# Altium schematic sheet Power_Logic.SchDoc
size A4
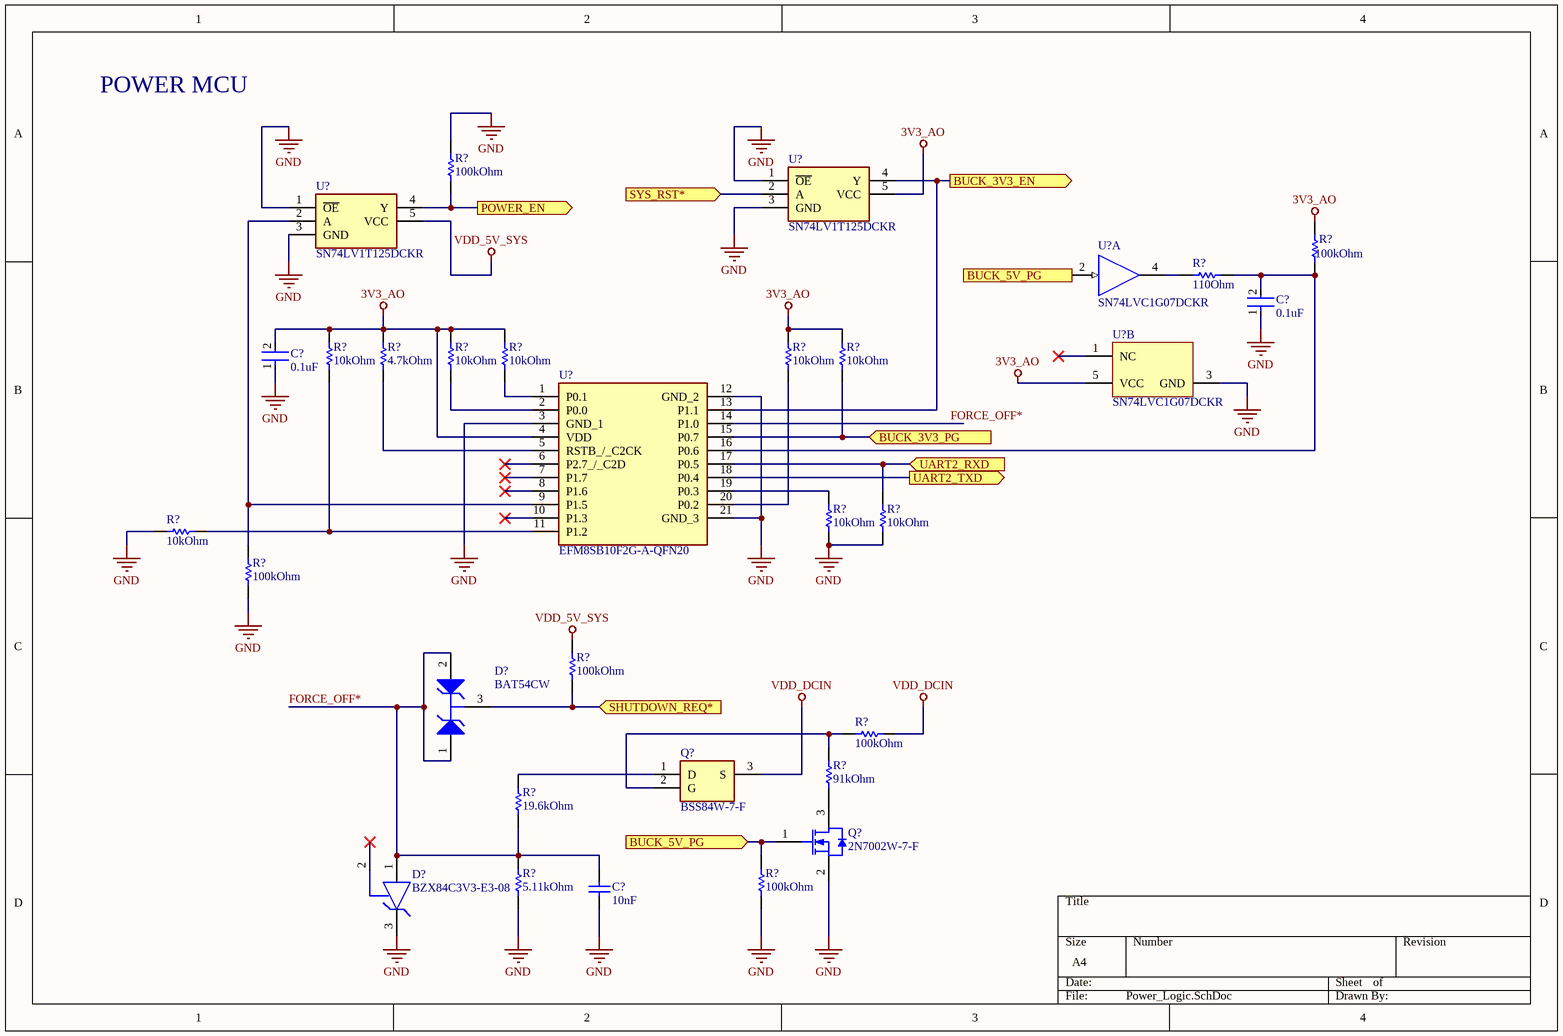
[diagram p0: Power_Logic.SchDoc]

## Parts
(Parts that share a designator on the sheet are numbered #1, #2 ... from top to bottom, then left to right.)
C?#1  0.1uF  [FP-C0603C-CF-MFG]
C?#2  0.1uF  [FP-C0603C-CF-MFG]
C?#3  10nF  [CAPC0603X33X15NL03T05]
D?#1  BAT54CW  [NXP-SOT323-3_L]
D?#2  BZX84C3V3-E3-08  [FP-6_541-5014_01-4-MFG]
Q?#1  BSS84W-7-F  [SOT65P210X110-3N]
Q?#2  2N7002W-7-F  [DIOD-SOT323-3_V]
R?#1  100kOhm  [RESC2013X50X30NL20T20]
R?#2  100kOhm  [RESC2013X50X30NL20T20]
R?#3  110Ohm  [RESC1609X50X30NL10T20]
R?#4  10kOhm  [RESC1608X55X30ML20T20]
R?#5  4.7kOhm  [RESC1609X50X30LL8T20]
R?#6  10kOhm  [RESC1608X55X30ML20T20]
R?#7  10kOhm  [RESC1608X55X30ML20T20]
R?#8  10kOhm  [RESC1608X55X30ML20T20]
R?#9  10kOhm  [RESC1608X55X30ML20T20]
R?#10  10kOhm  [RESC1608X55X30ML20T20]
R?#11  10kOhm  [RESC1608X55X30ML20T20]
R?#12  10kOhm  [RESC1608X55X30ML20T20]
R?#13  100kOhm  [RESC2013X50X30NL20T20]
R?#14  100kOhm  [RESC2013X50X30NL20T20]
R?#15  100kOhm  [RESC2013X50X30NL20T20]
R?#16  91kOhm  [RESC1609X50X30NL10T20]
R?#17  19.6kOhm  [RESC1005X35X20NL05T10]
R?#18  100kOhm  [RESC2013X50X30NL20T20]
R?#19  5.11kOhm  [RESC1005X40X25LL05T05]
U?#1  SN74LV1T125DCKR  [SOT65P210X110-5N]
U?#2  SN74LV1T125DCKR  [SOT65P210X110-5N]
U?#3  SN74LVC1G07DCKR  [DCK0005A_M]  (part A of 2)
U?#4  SN74LVC1G07DCKR  [DCK0005A_M]  (part B of 2)
U?#5  EFM8SB10F2G-A-QFN20  [EFM8SB10F8GAQFN20R]

## Ports
BUCK_3V3_EN (out), BUCK_3V3_PG (in), BUCK_5V_PG (in), POWER_EN (out), SHUTDOWN_REQ* (in), SYS_RST* (in), UART2_RXD (in), UART2_TXD (out)

## Nets
3V3_AO: C?#2.2 R?#2.1 R?#4.2 R?#5.2 R?#6.2 R?#7.2 R?#8.2 R?#9.2 U?#1.5(VCC) U?#4.5(VCC) U?#5.4(VDD)
GND: C?#1.1 C?#2.1 C?#3.1 D?#2.3(C) Q?#2.2(S) R?#1.1 R?#10.2 R?#11.2 R?#12.2 R?#13.2 R?#18.2 R?#19.1 U?#1.1(~{OE}) U?#1.3(GND) U?#2.1(~{OE}) U?#2.3(GND) U?#4.3(GND) U?#5.3(GND_1) U?#5.12(GND_2) U?#5.21(GND_3)
VDD_5V_SYS: R?#14.1 U?#2.5(VCC)
VDD_DCIN: Q?#1.3(S) R?#15.2
BUCK_3V3_EN: U?#1.4(Y) U?#5.13(P1.1) ; port BUCK_3V3_EN
BUCK_3V3_PG: R?#9.1 U?#5.15(P0.7) ; port BUCK_3V3_PG
BUCK_5V_PG: Q?#2.1(G) R?#18.1 U?#3.2(A) ; port BUCK_5V_PG
FORCE_OFF*: C?#3.2 D?#1.1(A1) D?#1.2(A2) D?#2.1(A) R?#17.1 R?#19.2 U?#5.14(P1.0)
POWER_EN: R?#1.2 U?#2.4(Y) ; port POWER_EN
SHUTDOWN_REQ*: D?#1.3(K) R?#14.2 ; port SHUTDOWN_REQ*
SYS_RST*: U?#1.2(A) ; port SYS_RST*
UART2_RXD: R?#11.1 U?#5.17(P0.5) ; port UART2_RXD
UART2_TXD: U?#5.18(P0.4) ; port UART2_TXD
NetC?#1_2: C?#1.2 R?#2.2 R?#3.2 U?#5.16(P0.6)
NetQ?#1_1: Q?#1.1(D) R?#17.2
NetQ?#1_2: Q?#1.2(G) R?#15.1 R?#16.1
NetQ?#2_3: Q?#2.3(D) R?#16.2
NetR?#3_1: R?#3.1 U?#3.4(Y)
NetR?#4_1: R?#4.1 R?#12.1 U?#5.11(P1.2)
NetR?#5_1: R?#5.1 U?#5.5(RSTB_/_C2CK)
NetR?#6_1: R?#6.1 U?#5.2(P0.0)
NetR?#7_1: R?#7.1 U?#5.1(P0.1)
NetR?#8_1: R?#8.1 U?#5.20(P0.2)
NetR?#10_1: R?#10.1 U?#5.19(P0.3)
NetR?#13_1: R?#13.1 U?#2.2(A) U?#5.9(P1.5)

Not connected (* = marked no-connect by the designer): D?#2 2(NC)*; U?#4 1(NC)*; U?#5 6(P2.7_/_C2D)* 7(P1.7)* 8(P1.6)* 10(P1.3)*

## Notes on the sheet
- POWER MCU

## Library data of the parts
C?#1 C?#2 = CMP-03020-001379-1: CAP CER 0.1UF 50V X7R 0603; Manufacturer: KEMET; Manufacturer Part Number: C0603C104K5RACTU; Tolerance: 0.1; Temperature Coefficient: 30ppm/°C; Material: Ceramic; Automotive Grade: Grade 1; Value: 0.10 μF; Temperature: -55°C to +125°C; RoHS: TRUE; Temperature Range High: +125°C; Lead Free: Yes; Octopart: https://octopart.com/c0603c104k5ractu-kemet-139244; Digikey Description: CAP CER 0.1UF 50V X7R 0603; Category: Cap; Package: C0603C-CF; ComponentLink2Description: Datasheet; Temperature Range Low: -55°C; Device Class L1: Passive Components; Voltage Rating: 50 V; Automotive: Yes; Device Class L3: Ceramic Capacitors; ComponentLink2URL: https://api.kemet.com/component-edge/download/datasheet/C0603C100J5GACAUTO.pdf; Capacitance: 0.10 μF; Device Class L2: Capacitors; Temperature Characteristic: X7R; Height: 0.87mm
C?#3 = CMP-2010-00230-1: Part Number: 0201ZC103KAT2A; Manufacturer: AVX Interconnect / Elco
D?#1 = CMP-0417-00001-1: SOT-323 Plastic-Encapsulated Diode; Manufacturer: NXP Semiconductors; Non-repetitive Peak Reverse Current: 600 mA; Max Forward Current: 200 mA; PackageVersion: Mar-06; ComponentLink3URL: http://www.nxp.com/documents/outline_drawing/sot323_po.pdf; Mounting Technology: Surface Mount; ComponentLink3Description: Package Specification; ComponentLink2Description: Datasheet; PartNumber: BAT54CW; Storage Temperature: -65 to 150 degC; DatasheetVersion: Rev. 3, 11/2012; ComponentLink2URL: http://www.nxp.com/documents/data_sheet/BAT54W_SER.pdf; ComponentLink1Description: Manufacturer URL; ComponentLink1URL: http://www.nxp.com/; PackageDescription: 3-Pin SOT323, 2 x 1.3 mm Body, 0.65 mm Pitch; PackageReference: SOT323-3
D?#2 = CMP-02541-000017-1: DIODE ZENER 3.3V 300MW SOT23; Manufacturer: Vishay; Reverse Voltage: 1V; Zener Impedance: 95Ω; Max Junction Temp: +150°C; Max Zener Voltage: 3.5V; Max Reverse Leakage Current: 5uA; Description: Diode Zener Single 3.3V 5% 300mW 3-Pin SOT-23 T/R; Device Class L1: Discrete Semiconductors; Digikey Description: DIODE ZENER 3.3V 300MW SOT23; ComponentLink2URL: http://www.vishay.com/docs/85763/bzx84v.pdf; Lead Free: Yes; Package: 6.541-5014.01-4; Automotive: No; Device Class L3: Zener Diodes; Mouser Description: Zener Diodes 3.3 Volt 0.35W 5%; Temperature Range Low: -55°C; Nom Zener Voltage: 3.3V; Manufacturer Part Number: BZX84C3V3-E3-08; Octopart: https://octopart.com/bzx84c3v3-e3-08-vishay-30324846; RoHS: TRUE; Device Class L2: Diodes; Category: Diode; Temperature Range High: +150°C; Temperature: -55°C to +150°C; Height: 1.15mm; ComponentLink2Description: Datasheet; Power Dissipation: 300mW
Q?#1 = BSS84W-7-F: Undefined or Miscellaneous; Manufacturer_Name: Diodes Inc.; Datasheet Link: http://componentsearchengine.com/Datasheets/1/BSS84W-7-F.pdf; Manufacturer_Part_Number: BSS84W-7-F; Arrow Part Number: BSS84W-7-F; Arrow Price/Stock: https://www.arrow.com/en/products/bss84w-7-f/diodes-incorporated; Mouser Part Number: 621-BSS84W-F; Mouser Price/Stock: https://www.mouser.co.uk/ProductDetail/Diodes-Incorporated/BSS84W-7-F?qs=C%2FiXDRqWM5gURToIay7bAQ%3D%3D
Q?#2 = CMP-2000-05568-1: N-Channel Enhancement Mode Field Effect Transistor, 60 V (VDS), 0.115 A (IDS), -55 to 150 degC, 3-Pin SOT323, RoHS, Tape and Reel; Manufacturer: DiodesIncorporated; Typical Turn-On Delay Time: 7ns; Configuration: Single; Id - Continuous Drain Current: 115mA; Transistor Type: 1N-Channel; Vgs - Gate-Source Voltage: 20V; Pd - Power Dissipation: 200mW; Unit Weight: 0.000212oz; Rds On - Drain-Source Resistance: 2.6Ohms; Forward Transconductance - Min: 0.08S; Number of Channels: 1Channel; Vds - Drain-Source Breakdown Voltage: 70V; Typical Turn-Off Delay Time: 11ns; Series: 2N7002; Transistor Polarity: N-Channel; Technology: Si; Product: MOSFETSmallSignal; Channel Mode: Enhancement; Datasheet URL: http://www.diodes.com/_files/datasheets/ds30099.pdf; Mounting Style: SMD/SMT; Packaging: Reel; Datasheet Version: Rev. 14-2, 09/2013; Package / Case: SOT-323-3; Length: 2.2mm; Manufacturer URL: http://www.diodes.com/; Height: 1mm; Factory Pack Quantity: 3000; Maximum Operating Temperature: +150C; Product Category: MOSFET; Minimum Operating Temperature: -55C; Type: EnhancementModeFieldEffectTransistor; Package Description: 3-Pin Small Outline Transistor, Body 2 x 1.25 mm, Pitch 0.65 mm; Width: 1.35mm; RoHS: True; Package Reference: SOT323; Mounting Technology: SurfaceMount; Brand: DiodesIncorporated
R?#1 R?#2 R?#13-R?#15 R?#18 = CMP-2001-04899-1: Part Number: CRCW0805100KFKEA; Manufacturer: Vishay Dale
R?#3 = CMP-2000-03854-1: Part Number: CRCW0603110RFKEA; Manufacturer: Vishay Dale
R?#4 R?#6-R?#12 = CMP-2000-00874-1: Part Number: ERA-3AEB103V; Manufacturer: Panasonic
R?#5 = CMP-1666-00019-2: Chip Resistor, 4.7 KOhm, +/- 1%, 100 mW, -55 to 155 degC, 0603 (1608 Metric), RoHS, Tape and Reel; Current Rating: 1.5 A; Connector Type: USB; Gender: Female; Min Operating Temperature: 0 degC; Pins: 4; PackageDescription: 2-Pin Surface Mount Device, Body 1.575 x 0.85 mm; ComponentLink1Description: Manufacturer URL; Packaging: Rail/Tube; Contact Plating: Nickel; DatasheetVersion: Jun-12; Package Quantity: 44; RoHSCompliant: true; Colour: Black; Max Operating Temperature: 40 degC; Contact Material: Copper; Radiation Hardening: No; Mount: Through Hole; ComponentLink2URL: http://www.vishay.com/docs/20035/dcrcwe3.pdf; PackageReference: 0603; ComponentLink2Description: Datasheet; ComponentLink1URL: http://www.vishay.com/; Height: 11 mm; REACH SVHC: No SVHC; Lead Pitch: 2.5 mm; Length: 12.2 mm
R?#16 = CMP-2000-03640-1: Part Number: CRCW060391K0FKEA; Manufacturer: Vishay Dale
R?#17 = CMP-2002-03168-1: Part Number: CPF0402B19K6E1; Manufacturer: TE Connectivity / AMP
R?#19 = CMP-2002-00117-1: Manufacturer: Vishay Dale; Part Number: CRCW04025K11FKED
U?#1 U?#2 = SN74LV1T125DCKR: Integrated Circuit; Manufacturer_Name: Texas Instruments; Datasheet Link: http://www.ti.com/lit/gpn/sn74lv1t125; Height: 1.1mm; Manufacturer_Part_Number: SN74LV1T125DCKR; Arrow Part Number: SN74LV1T125DCKR; Arrow Price/Stock: https://www.arrow.com/en/products/sn74lv1t125dckr/texas-instruments; Mouser Part Number: 595-SN74LV1T125DCKR; Mouser Price/Stock: https://www.mouser.co.uk/ProductDetail/Texas-Instruments/SN74LV1T125DCKR?qs=8sOby8ZxZLEEpIbhoTKj7w%3D%3D
U?#3 U?#4 = CMP-0859-00290-3: Single Buffer/Driver With Open-Drain Output, DCK0005A, LARGE T&R; Manufacturer: Texas Instruments; 3-State Output: No; F @ Nom Voltage(Max)(Mhz): 150; ICC @ Nom Voltage(Max)(mA): 0.01; VCC(Min)(V): 1.65; Logic: True; Sub-Family: Non-Inverting Buffer/Driver; Output Drive (IOL/IOH)(Max)(mA): 32/-32; Input Type: CMOS/TTL; Technology Family: LVC; Bits(#): 1; VCC(Max)(V): 5.5; Output Type: CMOS; tpd @ Nom Voltage(Max)(ns): 8.6,6,4.7,4; Rating: Catalog; Voltage(Nom)(V): 1.8,2.5,3.3,5; Generic Part Number: SN74LVC1G07; PackageReference: DCK0005A; DatasheetVersion: SCES296AC; Operating Temperature Range(C): -40 to 125,-40 to 85; Schmitt Trigger: No
U?#5 = EFM8SB10F2G-A-QFN20: Integrated Circuit; Manufacturer_Name: Silicon Labs; Datasheet Link: https://www.silabs.com/documents/public/data-sheets/efm8sb1-datasheet.pdf; Height: 0.6mm; Manufacturer_Part_Number: EFM8SB10F2G-A-QFN20; Arrow Part Number: EFM8SB10F2G-A-QFN20; Arrow Price/Stock: https://www.arrow.com/en/products/efm8sb10f2g-a-qfn20/silicon-labs; Mouser Part Number: 634-8SB10F2GAQF20; Mouser Price/Stock: https://www.mouser.co.uk/ProductDetail/Silicon-Labs/EFM8SB10F2G-A-QFN20?qs=DCjbIwhU0Zv4HMgdSm4N7w%3D%3D